# Altium schematic sheet Lighting.SchDoc
size A; SheetNumber: 12; SheetTotal: 12
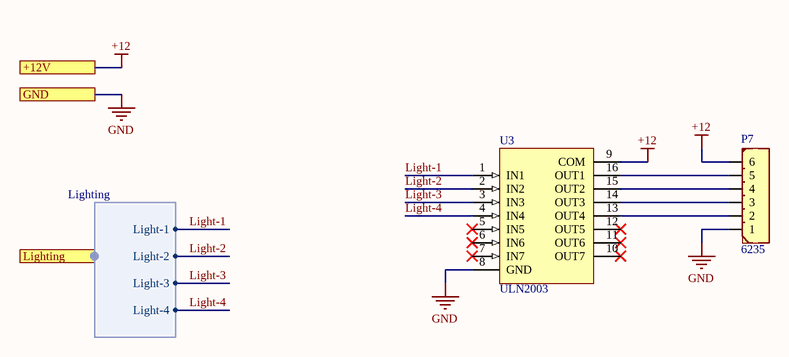
[diagram p0: Lighting.SchDoc]

## Parts
P7  Inflow: 6235  [645006114822]  (hidden comment: 6'Pin)
U3  ULN2003  [SO16_M]

## Ports
+12V, GND, Lighting (harness Lighting)

## Harnesses
Lighting: Light-1, Light-2, Light-3, Light-4

## Nets
+12: P7.6 U3.9(COM) ; port +12V
GND: P7.1 U3.8(GND) ; port GND
Light-1: U3.1(IN1) ; port Lighting.Light-1
Light-2: U3.2(IN2) ; port Lighting.Light-2
Light-3: U3.3(IN3) ; port Lighting.Light-3
Light-4: U3.4(IN4) ; port Lighting.Light-4
NetP7_2: P7.2 U3.13(OUT4)
NetP7_3: P7.3 U3.14(OUT3)
NetP7_4: P7.4 U3.15(OUT2)
NetP7_5: P7.5 U3.16(OUT1)

Not connected (* = marked no-connect by the designer): U3 5(IN5)* 6(IN6)* 7(IN7)* 10(OUT7)* 11(OUT6)* 12(OUT5)*

## Library data of the parts
P7 = Con_Power_6_PC_V: 6'Pin Power Connector; Rating: Rating?; Validation: Valid; Value: 6'Pin; Package: Package?; Type: Type?
U3 = IC_Driver_ULN2003: Seven darlington array drivers; Rating: Rating?; Validation: Valid; Inflow: 1506; Package: SO-16; Type: Driver; Value: ULN2003